# EAGLE schematic LibreServo-v2.3.1 (EAGLE 7.6.0)
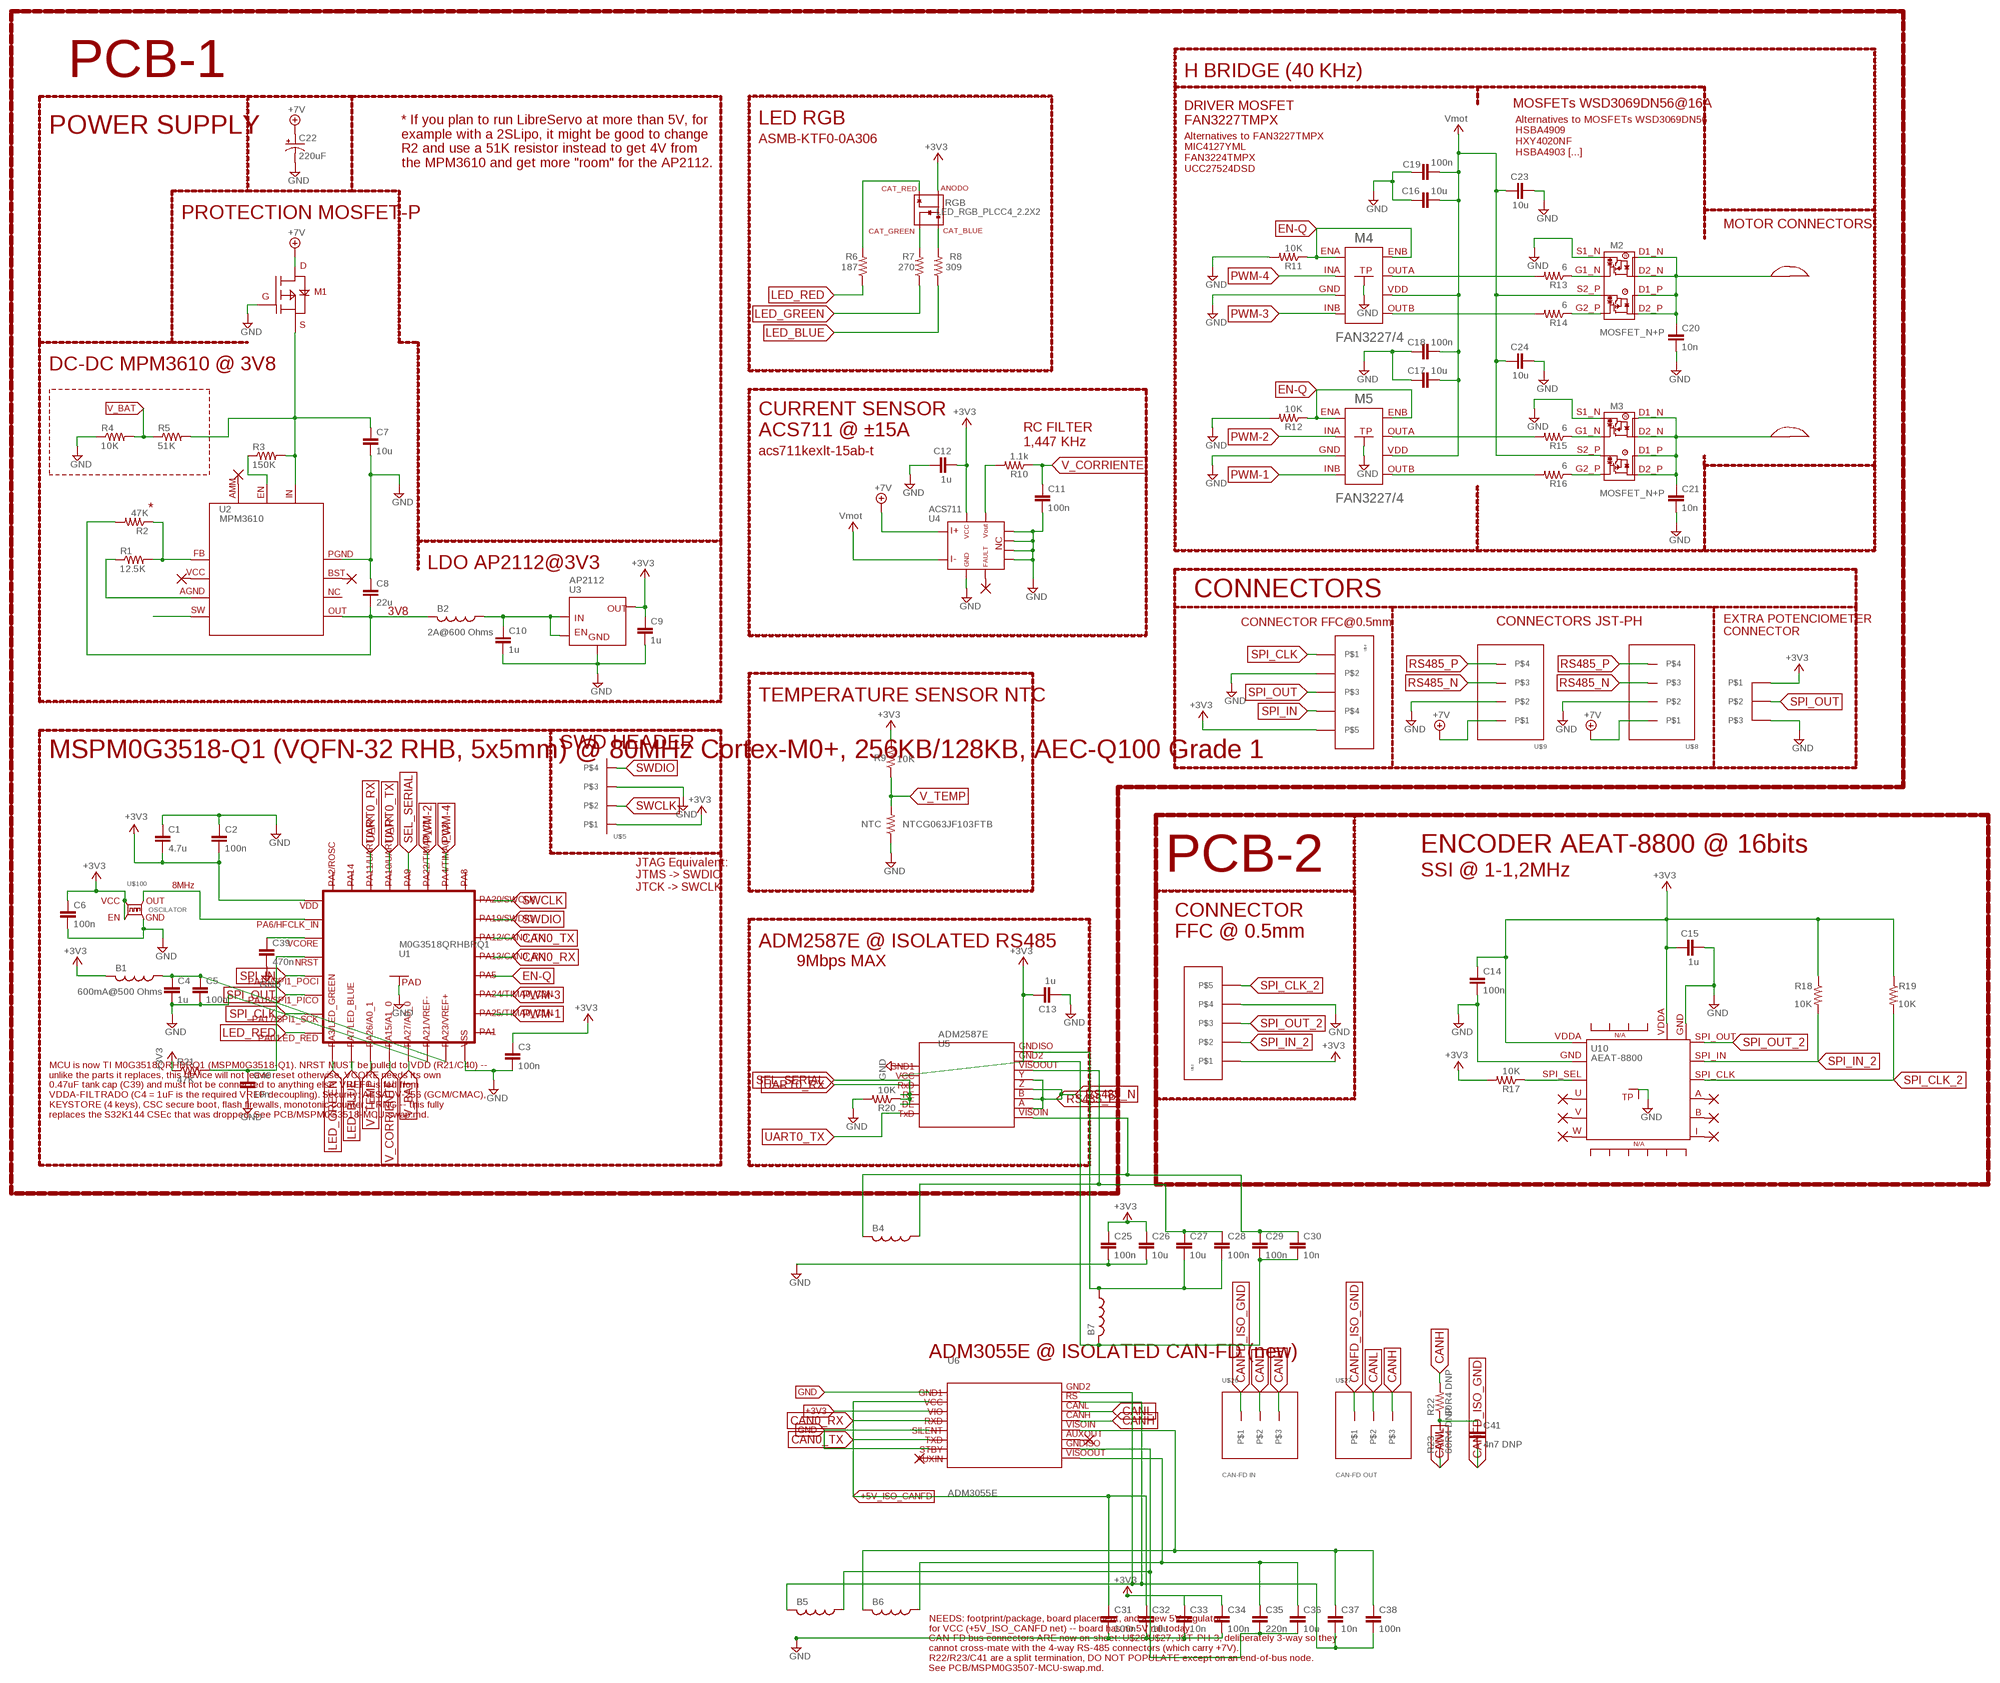
[diagram p0: schematic, sheet 1]

## Parts
B1  FERRITE_BEAD_0402  [0402]
B2  FERRITE_BEAD_0603  [0603]
B4  FERRITE_BEAD_0603  [0603]
B5  FERRITE_BEAD_0603  [0603]
B6  FERRITE_BEAD_0603  [0603]
B7  FERRITE_BEAD_0603  [0603]
C1  4.7u  C-EU0402  [0402]
C2  100n  C-EU0402  [0402]
C3  100n  C-EU0402  [0402]
C4  1u  C-EU0402  [0402]
C5  100n  C-EU0402  [0402]
C6  100n  C-EU0402  [0402]
C7  10u  C-EU0603  [0603]
C8  22u  C-EU1206  [1206]
C9  1u  C-EU0402  [0402]
C10  1u  C-EU0402  [0402]
C11  100n  C-EU0402  [0402]
C12  1u  C-EU0402  [0402]
C13  1u  C-EU0402  [0402]
C14  100n  C-EU0402  [0402]
C15  1u  C-EU0402  [0402]
C16  10u  C-EU0603  [0603]
C17  10u  C-EU0603  [0603]
C18  100n  C-EU0402  [0402]
C19  100n  C-EU0402  [0402]
C20  10n  C-EU0402  [0402]
C21  10n  C-EU0402  [0402]
C22  220uF  CPOL-USE2,5-6_MIN  [E2,5-6_MIN]
C23  10u  C-EU0603  [0603]
C24  10u  C-EU0603  [0603]
C25  100n  C-EU0402  [0402]
C26  10u  C-EU0603  [0603]
C27  10u  C-EU0603  [0603]
C28  100n  C-EU0402  [0402]
C29  100n  C-EU0402  [0402]
C30  10n  C-EU0402  [0402]
C31  100n  C-EU0402  [0402]
C32  10u  C-EU0603  [0603]
C33  10n  C-EU0402  [0402]
C34  100n  C-EU0402  [0402]
C35  220n  C-EU0402  [0402]
C36  10u  C-EU0603  [0603]
C37  10n  C-EU0402  [0402]
C38  100n  C-EU0402  [0402]
C39  470n  C-EU0402  [0402]
C40  10n  C-EU0402  [0402]
C41  4n7 DNP  C-EU0402  [0402]
M1  M1  P5103EMA  [SOT23]
M2  MOSFET_N+P  [DFN5X6]
M3  MOSFET_N+P  [DFN5X6]
M4  FAN3227/4  FAN3227/3  [MLP8]
M5  FAN3227/4  FAN3227/3  [MLP8]
NTC  R-US0402_MIN  [0402_MIN]
R1  12.5K  R-US0402  [0402]
R2  47K  R-US0402  [0402]
R3  150K  R-US0402  [0402]
R4  10K  R-US0402  [0402]
R5  51K  R-US0402  [0402]
R6  187  R-US0402  [0402]
R7  270  R-US0402  [0402]
R8  309  R-US0402  [0402]
R9  10K  R-US0402  [0402]
R10  1.1k  R-US0402  [0402]
R11  10K  R-US0402  [0402]
R12  10K  R-US0402  [0402]
R13  6  R-US0402  [0402]
R14  6  R-US0402  [0402]
R15  6  R-US0402  [0402]
R16  6  R-US0402  [0402]
R17  10K  R-US0402  [0402]
R18  10K  R-US0402  [0402]
R19  10K  R-US0402  [0402]
R20  10K  R-US0402  [0402]
R21  47K  R-US0402  [0402]
R22  60R4 DNP  R-US0402  [0402]
R23  60R4 DNP  R-US0402  [0402]
RGB  LED_RGB_PLCC4_2.2X2  [PLCC-4_2.2X2]
U1  M0G3518QRHBRQ1  MSPM0G3518  (no package)
U2  MPM3610  MPM36XX  [MPM36XX]
U3  AP2112  [SOT25]
U4  ACS711  [ACS711-QFN]
U5  ADM2587E  (no package)
U6  ADM3055E  (no package)
U10  AEAT-8800  [QFN24]
U$1  SLOT  [SERVO_SLOT]
U$2  SLOT  [SERVO_SLOT]
U$3  FFC-5  [FFC-5-0.5]
U$4  FFC-5  [FFC-5-0.5]
U$5  HEADER_4_1.27_0.3  [HEADER_4_1.27_0.3]
U$6  POTEN_SERVO  [POTEN_SERVO]
U$7  NC_MARKER  (no package)
U$8  JST_PH-4_HOLEB  [JST_PH-4_HOLE_B]
U$9  JST_PH-4_HOLEB  [JST_PH-4_HOLE_B]
U$10  NC_MARKER  (no package)
U$11  NC_MARKER  (no package)
U$17  NC_MARKER  (no package)
U$18  NC_MARKER  (no package)
U$19  NC_MARKER  (no package)
U$20  NC_MARKER  (no package)
U$21  NC_MARKER  (no package)
U$22  NC_MARKER  (no package)
U$23  NC_MARKER  (no package)
U$24  NC_MARKER  (no package)
U$25  NC_MARKER  (no package)
U$26  CAN-FD IN  JST_PH-3_HOLE  (no package)
U$27  CAN-FD OUT  JST_PH-3_HOLE  (no package)
U$100  OSCILATOR  [OSC-2X1.6]

## Nets
711_OUT: R10.2 U4.P$11
+3V3: B1.2 C1.2 C2.2 C3.1 C6.1 C9.1 C12.2 C13.2 C25.1 C26.1 C33.1 C34.1 R9.2 R21.1 RGB.P$1(ANODO) U1.VDD U3.5 U4.P$12 U5.VCC U6.VIO U$4.P$5 U$5.P$1 U$6.P$1 U$100.P$1(EN) U$100.P$4(VCC)
+3V3_2: C14.1 C15.1 R17.2 R18.1 R19.1 U10.P$14 U10.P$19 U$3.P$1 ; supply symbol labelled +3V3
+5V_ISO_CANFD [Diff]: C31.1 C32.1 U6.VCC
+7V: C22.+ M1.P$2(D) U4.P$1 U$8.P$1 U$9.P$1
CAN0_RX: U1.PA13/CAN0_RX U6.RXD
CAN0_TX: U1.PA12/CAN0_TX U6.TXD
CAN_SPLIT [Diff]: C41.1 R22.1 R23.2
CANFD_GNDISO [Diff]: B5.1 C35.2 C36.2 U6.GNDISO
CANFD_ISO_GND [Diff]: B5.2 C37.2 C38.2 C41.2 U6.GND2 U6.RS U$26.P$1 U$27.P$1
CANFD_VISOIN [Diff]: B6.2 C37.1 C38.1 U6.VISOIN
CANFD_VISOOUT [Diff]: B6.1 C35.1 C36.1 U6.VISOOUT
CANH [Diff]: R22.2 U6.CANH U$26.P$3 U$27.P$3
CANL [Diff]: R23.1 U6.CANL U$26.P$2 U$27.P$2
CLK-8MHZ: U1.PA6/HFCLK_IN U$100.P$3(OUT)
EN-Q: M4.P$1(ENA) M4.P$8(ENB) M5.P$1(ENA) M5.P$8(ENB) R11.1 R12.1 U1.PA5
GND: C1.1 C2.1 C3.2 C4.2 C5.2 C6.2 C7.2 C8.1 C9.2 C10.2 C11.2 C12.1 C13.1 C16.1 C17.1 C18.1 C19.1 C20.2 C21.2 C22.- C23.2 C24.2 C25.2 C26.2 C31.2 C32.2 C33.2 C34.2 C39.2 C40.2 M1.P$1(G) M2.P$1(S1_N) M3.P$1(S1_N) M4.P$3(GND) M4.P$9(TP) M5.P$3(GND) M5.P$9(TP) NTC.1 R4.1 R11.2 R12.2 R20.2 U1.PA21/VREF- U1.PAD U1.VSS U2.P$12(P$8_PGND) U2.P$13(P$8_PGND) U2.P$14(P$8_PGND) U3.2 U4.P$5 U4.P$7 U4.P$8 U4.P$9 U4.P$10 U5.GND1 U6.GND1 U6.SILENT U6.STBY U$4.P$2 U$5.P$3 U$6.P$3 U$8.P$2 U$9.P$2 U$100.P$2(GND)
GND_2: C14.2 C15.2 U10.P$13 U10.P$20 U10.P$25 U$3.P$4 ; supply symbol labelled GND
IN_AP2112: B2.1 C10.1 U3.1 U3.3
LED_BLUE: R8.1 U1.PA7/LED_BLUE
LED_GREEN: R7.1 U1.PA3/LED_GREEN
LED_RED: R6.1 U1.PA0/LED_RED
M1-OUT: C7.1 M1.P$3(S) R3.2 R5.2 U2.P$16(P$9_IN)
M2-OUT: C20.1 M2.P$5(D2_P) M2.P$6(D1_P) M2.P$7(D2_N) M2.P$8(D1_N) M2.P$9(D1_N) U$1.P$1
M3-OUT: C21.1 M3.P$5(D2_P) M3.P$6(D1_P) M3.P$7(D2_N) M3.P$8(D1_N) M3.P$9(D1_N) U$2.P$1
M4-OUTA: M4.P$7(OUTA) R13.2
M4-OUTA-IN: M2.P$2(G1_N) R13.1
M4-OUTB: M4.P$5(OUTB) R14.2
M4-OUTB-IN: M2.P$4(G2_P) R14.1
M5-OUTA: M5.P$7(OUTA) R15.2
M5-OUTA-IN: M3.P$2(G1_N) R15.1
M5-OUTB: M5.P$5(OUTB) R16.2
M5-OUTB-IN: M3.P$4(G2_P) R16.1
MPM3610_AGND: R1.1 U2.P$3(P$3_AGND)
MPM3610_EN: R3.1 U2.P$17(P$10_EN)
MPM3610_FB: R1.2 R2.1 U2.P$1(P$1_FB)
MPM3610_SW: U2.P$4(P$4_SW) U2.P$5(P$4_SW) U2.P$6(P$4_SW)
N$1: R6.2 RGB.P$4(CAT_RED)
N$2: U2.P$2(P$2_VCC) U$7.P$1
N$3: U2.P$18(P$11_AMM) U$10.P$1
N$4: R7.2 RGB.P$3(CAT_GREEN)
N$5: R8.2 RGB.P$2(CAT_BLUE)
N$6: U2.P$11(P$7_BST) U$11.P$1
N$12: U10.P$22 U$17.P$1
N$13: U10.P$23 U$18.P$1
N$14: U10.P$24 U$19.P$1
N$15: U10.P$7 U$20.P$1
N$16: U10.P$8 U$21.P$1
N$17: R17.1 U10.P$21
N$18: U10.P$9 U$22.P$1
N$19: U4.P$6 U$23.P$1
N$20: U6.AUXIN U$24.P$1
N$21: U6.AUXOUT U$25.P$1
NRST: C40.1 R21.2 U1.NRST
OUT_MPM3610: B2.2 C8.2 R2.2 U2.P$7(P$5_OUT) U2.P$8(P$5_OUT) U2.P$9(P$5_OUT)
PWM-1: M5.P$4(INB) U1.PA25/TIMA0_C1N
PWM-2: M5.P$2(INA) U1.PA22/TIMA0_C1
PWM-3: M4.P$4(INB) U1.PA24/TIMA0_C3N
PWM-4: M4.P$2(INA) U1.PA4/TIMA0_C3
RS485_GNDISO [Diff]: B7.1 C27.2 C28.2 U5.GNDISO
RS485_ISO_GND [Diff]: B7.2 C29.2 C30.2 U5.GND2
RS485_N [Diff]: U5.B U5.Z U$8.P$3 U$9.P$3
RS485_P [Diff]: U5.A U5.Y U$8.P$4 U$9.P$4
RS485_VISOIN [Diff]: B4.2 C29.1 C30.1 U5.VISOIN
RS485_VISOOUT [Diff]: B4.1 C27.1 C28.1 U5.VISOOUT
SEL_SERIAL: R20.1 U1.PA9 U5.DE U5.RE
SPI_CLK: U1.PA17/SPI1_SCK U$4.P$1
SPI_CLK_2: R19.2 U10.P$10 U$3.P$5
SPI_IN: U1.PA16/SPI1_POCI U$4.P$4
SPI_IN_2: R18.2 U10.P$11 U$3.P$2
SPI_OUT: U1.PA18/SPI1_PICO U$4.P$3 U$6.P$2
SPI_OUT_2: U10.P$12 U$3.P$3
SWCLK: U1.PA20/SWCLK U$5.P$2
SWDIO: U1.PA19/SWDIO U$5.P$4
UART0_RX: U1.PA11/UART0_RX U5.RxD
UART0_TX: U1.PA10/UART0_TX U5.TxD
V_BAT: R4.2 R5.1 U1.PA27/A0_0
V_CORRIENTE: C11.1 R10.1 U1.PA15/A1_0
V_TEMP: NTC.2 R9.1 U1.PA26/A0_1
VCORE: C39.1 U1.VCORE
VDDA-FILTRADO: B1.1 C4.1 C5.1 U1.PA23/VREF+
VMOT: C16.2 C17.2 C18.2 C19.2 C23.1 C24.1 M2.P$3(S2_P) M3.P$3(S2_P) M4.P$6(VDD) M5.P$6(VDD) U4.P$3 ; supply symbol labelled Vmot
Unconnected: U1.PA1 U1.PA2/ROSC U1.PA8 U1.PA14 U2.P$10(P$6_NC) U2.P$15(P$6_NC) U10.P$1 U10.P$2 U10.P$3 U10.P$4 U10.P$5 U10.P$6 U10.P$15 U10.P$16 U10.P$17 U10.P$18 U$1.P$2 U$2.P$2

## Notes on the sheet
- PCB-1 | H BRIDGE (40 KHz)
- MOSFETs WSD3069DN56@16A
- LED RGB
- DRIVER MOSFET
  FAN3227TMPX
- POWER SUPPLY
- ASMB-KTF0-0A306
- Alternatives to MOSFETs WSD3069DN56
  HSBA4909
  HXY4020NF
  HSBA4903 [...]
- * If you plan to run LibreServo at more than 5V, for
  example with a 2SLipo, it might be good to change
  R2 and use a 51K resistor instead to get 4V from
  the MPM3610 and get more "room" for the AP2112.
- Alternatives to FAN3227TMPX
  MIC4127YML
  FAN3224TMPX
  UCC27524DSD
- PROTECTION MOSFET-P
- MOTOR CONNECTORS
- M1
- DC-DC MPM3610 @ 3V8
- CURRENT SENSOR
  ACS711 @ ±15A
- RC FILTER
  1,447 KHz
- acs711kexlt-15ab-t
- *
- LDO AP2112@3V3
- CONNECTORS
- 3V8
- CONNECTOR FFC@0.5mm | CONNECTORS JST-PH
- 2A@600 Ohms
- EXTRA POTENCIOMETER
  CONNECTOR
- TEMPERATURE SENSOR NTC
- SWD HEADER
- MSPM0G3518-Q1 (VQFN-32 RHB, 5x5mm) @ 80MHz Cortex-M0+, 256KB/128KB, AEC-Q100 Grade 1
- NTCG063JF103FTB
- ENCODER AEAT-8800 @ 16bits
- PCB-2 | SSI @ 1-1,2MHz
- 8MHz
- JTAG Equivalent:
  JTMS -> SWDIO
  JTCK -> SWCLK
- CONNECTOR
  FFC @ 0.5mm
- ADM2587E @ ISOLATED RS485
- 9Mbps MAX
- 600mA@500 Ohms
- MCU is now TI M0G3518QRHBRQ1 (MSPM0G3518-Q1). NRST MUST be pulled to VDD (R21/C40) --
  unlike the parts it replaces, this device will not leave reset otherwise. VCORE needs its own
  0.47uF tank cap (C39) and must not be connected to anything else. VREF+ is fed from
  VDDA-FILTRADO (C4 = 1uF is the required VREF decoupling). Security: AESADV-256 (GCM/CMAC),
  KEYSTORE (4 keys), CSC secure boot, flash firewalls, monotonic counter, TRNG -- this fully
  replaces the S32K144 CSEc that was dropped. See PCB/MSPM0G3518-MCU-swap.md.
- ADM3055E @ ISOLATED CAN-FD (new)
- NEEDS: footprint/package, board placement, and a new 5V regulator
  for VCC (+5V_ISO_CANFD net) -- board has no 5V rail today.
  CAN-FD bus connectors ARE now on-sheet: U$26/U$27, JST-PH-3, deliberately 3-way so they
  cannot cross-mate with the 4-way RS-485 connectors (which carry +7V).
  R22/R23/C41 are a split termination, DO NOT POPULATE except on an end-of-bus node.
  See PCB/MSPM0G3507-MCU-swap.md.

## Library data of the parts
B1 = Propio:FERRITE_BEAD_0402
B2 B4-B7 = Propio:FERRITE_BEAD_0603
C1-C21 C23-C41 = Propio:C-EU
C22 = rcl:CPOL-US: POLARIZED CAPACITOR, American symbol
M1 = Propio:P5103EMA
M2 M3 = Propio:MOSFET_N+P
M4 M5 = Propio:FAN3227/3
NTC R1-R23 = Propio:R-US
RGB = Propio:LED_RGB_PLCC4_2.2X2
U1 = Propio:MSPM0G3518: TI MSPM0G3518-Q1 (VQFN-32, RHB, 5x5mm), Arm Cortex-M0+ @ 80MHz, 256KB flash (ECC, dual-bank 2x128KB with address swap for OTA) + 16KB data flash, 128KB SRAM (64KB with ECC/parity), native CAN-FD, 2x 12-bit 4Msps ADC (16 ch on this package), 12-bit DAC, 3x COMP, MATHACL, 12-ch DMA. AEC-Q100 Grade 1, wettable flank. Security stack (datasheet section 8.18 + TI SLAAE29A Table 1-2, column M0Gx5 1x): AESADV 128/256-bit with GCM/GMAC, CCM/CBC-MAC, CMAC, CBC, CTR; KEYSTORE secure key storage for up to 4 AES keys (write-only to the application, private bus to the AES engine); Customer Secure Code (CSC) secure boot with both hardware AES-CMAC and software ECDSA P-256 image authentication; flash write/read-execute/IP-protection firewalls; SRAM W^X; hardware monotonic counter for rollback protection; TRNG with health tests; CRC-16/32. PSA-L1 targeted, EVITA-Light. Pin names carry the physical port and the selected IOMUX function, both taken from the local datasheet copy Open-Secure-ESC/docs/datasheets/mspm0g3519-q1.pdf (SLASFA6B), Table 6-2 'Pin Attributes', column 'RHB PIN'. Symbol-only deviceset: no footprint yet. The existing Propio QFN32 land pattern is NOT reusable -- its pad numbering starts on the bottom row (TI RHB0032T starts on the left column, a 90-degree difference) and its pad span is 5.5mm vs TI's 4.78mm. TI's recommended land pattern (datasheet section 12, drawing 4224744/A): 32x pads 0.62 x 0.25mm on 0.5mm pitch, 4.78mm row-to-row span, 3.45 x 3.45mm exposed thermal pad (pad 33). See PCB/MSPM0G3518-MCU-swap.md.
U2 = Propio:MPM36XX
U3 = Propio:AP2112
U4 = Propio:ACS711
U5 = Propio:ADM2587E: ADM2587E isolated RS-485 transceiver. Symbol-only placeholder: footprint/package not yet defined, see PCB/RS485-CANFD-TPM-upgrade.md.
U6 = Propio:ADM3055E: ADM3055E isolated CAN-FD transceiver. Symbol-only placeholder: footprint/package not yet defined, see PCB/RS485-CANFD-TPM-upgrade.md.
U10 = Propio:AEAT-8800
U$1 U$2 = Propio:SLOT
U$3 U$4 = Propio:FFC-5
U$5 = Propio:HEADER_4
U$6 = Propio:POTEN_SERVO
U$7 U$10 U$11 U$17-U$25 = NC_MARKER:NC_MARKER
U$8 U$9 = Propio:JST_PH-4_HOLE
U$26 U$27 = Propio:JST_PH-3_HOLE: 3-way JST PH (2.0mm) CAN-FD bus connector. Deliberately 3-way, not 4-way: the RS-485 daisy-chain connectors are JST_PH-4_HOLE and carry +7V, so a 4-way CAN port would be cross-mateable with them and would drive +7V onto the isolated CAN bus. Pinout P$1=CAN_GND (bus-side isolated ground), P$2=CANL, P$3=CANH -- CANH/CANL kept adjacent for twisted-pair continuity. Symbol-only: footprint pending, and is a trivial one-position derivative of the existing JST_PH-4_HOLE_B land pattern. See PCB/MSPM0G3507-MCU-swap.md.
U$100 = Propio:OSCILATOR

## Net classes
1 Diff: width 0.178 mm, clearance 0.152 mm